# Altium schematic sheet 4_bat_input&power_monitor.SchDoc: Battery input & Power monitor
size A4; SheetNumber: 4; SheetTotal: 4
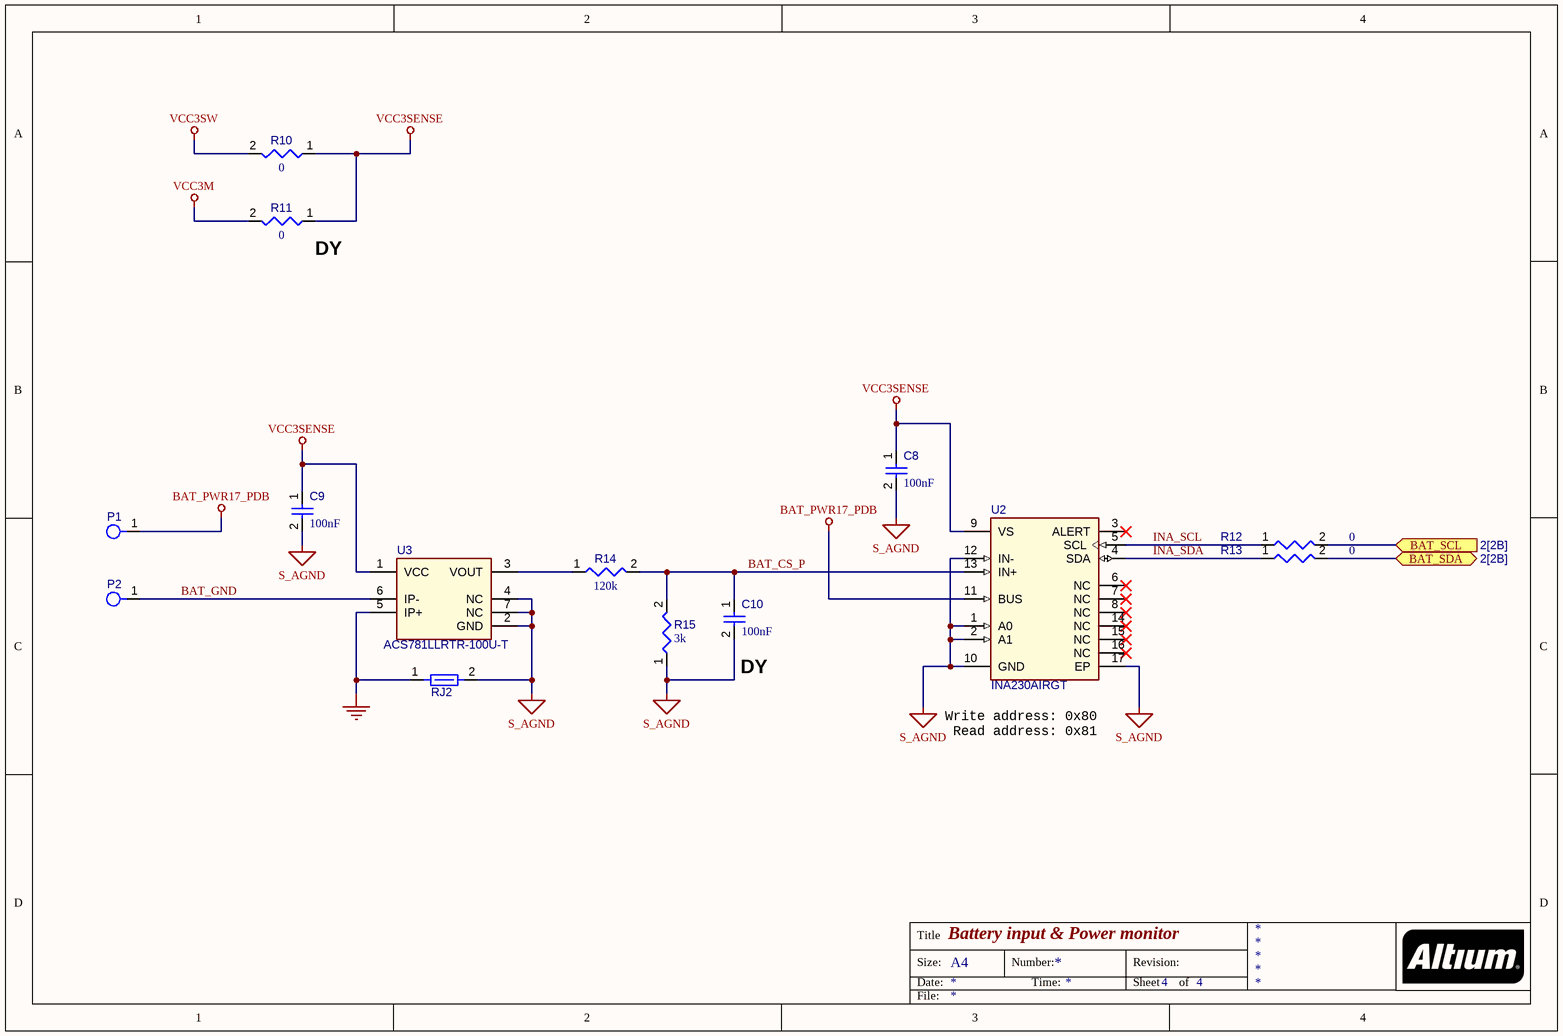
[diagram p0: 4_bat_input&power_monitor.SchDoc]

## Parts
C8  value 100nF  [CAPC0402(1005)60_L]  (hidden comment: Capacitor 100nF +/-20% 50V 0402)
C9  value 100nF  [CAPC0402(1005)60_L]  (hidden comment: Capacitor 100nF +/-20% 50V 0402)
C10  value 100nF  [CAPC0402(1005)60_L]  (hidden comment: Capacitor 100nF +/-20% 50V 0402)
P1  WIRE_PAD_7x4  [WIRE_PAD_7x4-Footprint-1]  (value not drawn)  (no BOM)
P2  WIRE_PAD_7x4  [WIRE_PAD_7x4-Footprint-1]  (value not drawn)  (no BOM)
R10  value 0  [RESC0402(1005)_L]  (hidden comment: Jumper 0402)
R11  value 0  [RESC0402(1005)_L]  (hidden comment: Jumper 0402)
R12  value 0  [RESC0402(1005)_L]  (hidden comment: Jumper 0402)
R13  value 0  [RESC0402(1005)_L]  (hidden comment: Jumper 0402)
R14  value 120k  [RESC0402(1005)_L]  (hidden comment: Resistor 120K +/-1 % 0402 63 mW)
R15  value 3k  [RESC0402(1005)_L]  (hidden comment: Resistor 3K +/-1 % 0402 63 mW)
RJ2  Net Tie 10x8mil  [New footprint 1]  (value not drawn)  (net tie, no BOM)
U2  INA230AIRGT  [RGT0016C_V]
U3  ACS781LLRTR-100U-T  [ALEG-PSOF-7_V]

## Ports
BAT_SCL (in, see 2[2B]), BAT_SDA (bidir, see 2[2B])

## Nets
BAT_PWR17_PDB: P1.1(H1) U2.11(BUS)
GND: RJ2.1 U3.5(IP+)
S_AGND: C8.2 C9.2 C10.2 R15.1 RJ2.2 U2.1(A0) U2.2(A1) U2.10(GND) U2.12(IN-) U2.17(EP) U3.2(GND) U3.4(NC) U3.7(NC)
VCC3M: R11.2
VCC3SENSE: C8.1 C9.1 R10.1 R11.1 U2.9(VS) U3.1(VCC)
VCC3SW: R10.2
BAT_CS_P: C10.1 R14.2 R15.2 U2.13(IN+)
BAT_GND: P2.1(H1) U3.6(IP-)
BAT_SCL: R12.2 ; port BAT_SCL
BAT_SDA: R13.2 ; port BAT_SDA
INA_SCL: R12.1 U2.5(SCL)
INA_SDA: R13.1 U2.4(SDA)
NetR14_1: R14.1 U3.3(VOUT)

Not connected (* = marked no-connect by the designer): U2 3(ALERT)* 6(NC)* 7(NC)* 8(NC)* 14(NC)* 15(NC)* 16(NC)*

## Notes on the sheet
- (near R11) DY
- (near C10) DY
- (near U2) Write address: 0x80
  Read address: 0x81
- Title
- Size:
- Date:
- A4
- Number:
- Time:
- Revision:
- Sheet
- of
- File:

## Library data of the parts
C8-C10 = CMP-001-00067-3: Chip Capacitor, 100nF +/-20%, 50V, 0402, Thickness 0.6 mm; Tolerance: 10%; Mounting Technology: SMT; Voltage Rating: 50V; Pins: 2; Case/Package: 0402; Max Operating Temperature: 85°C; Min Operating Temperature: -55°C
P1 P2 = CMP-019-00043-3: SMD WIRE PAD 7 x 4 mm; Pins: 1
R10-R13 = CMP-009-00148-3: Case/Package: 0402; Max Operating Temperature: 155°C; Min Operating Temperature: -55°C; Pins: 2
R14 = CMP-009-00146-3: Chip Resistor, 120 kOhms, +/-1 %, 63 mW, -55 to 155 degC, 0402; Tolerance: 1%; Power: 63mW; Case/Package: 0402; Max Operating Temperature: 155°C; Min Operating Temperature: -55°C; Pins: 2
R15 = CMP-009-00145-3: Chip Resistor, 3 kOhms, +/-1 %, 63 mW, -55 to 155 degC, 0402; Power: 63mW; Tolerance: 1%; Case/Package: 0402; Max Operating Temperature: 155°C; Min Operating Temperature: -55°C; Pins: 2
RJ2 = CMP-009-00116-2: Pins: 2; Max Operating Temperature: 155°C; Min Operating Temperature: -55°C
U2 = CMP-014-00001-3: High or Low Side Measurement, 2.7 to 5.5 V, -40 to 125 degC, 16-Pin QFN, RoHS, Tape and Reel; Mounting Technology: SurfaceMount; Pins: 17
U3 = CMP-031-00005-2: High-Precision Linear Hall-Effect-Based Current Sensor IC with 200 u? Current Conductor, 3 to 3.6 V, -40 to 150 degC, 7-Pin PSOF, RoHS, Tape and Reel; Pins: 7